# Altium schematic sheet 05_03_Buf_and_Not_Gates.SchDoc
size 111 x 66 mm
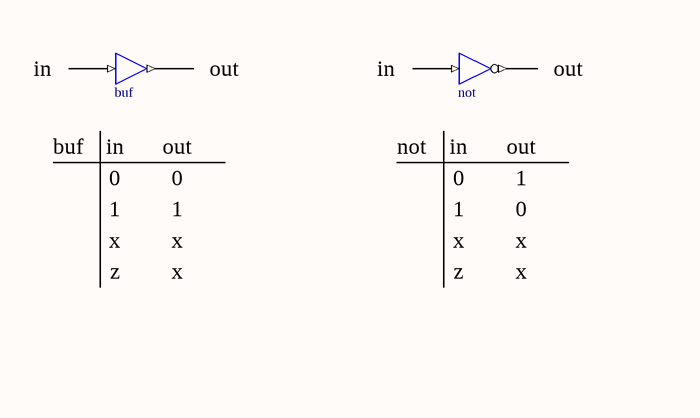
[diagram p0: 05_03_Buf_and_Not_Gates.SchDoc]

## Parts
(Parts that share a designator on the sheet are numbered #1, #2 ... from top to bottom, then left to right.)
U?#1  buf
U?#2  not

## Nets

Not connected (* = marked no-connect by the designer): U?#1 I O; U?#2 I O

## Notes on the sheet
- in
- out
- buf
- 0
- 1
- not
- x
- z

## Library data of the parts
U?#1 U?#2 = BUF: 1-bit General Purpose (Non-inverting) Buffer